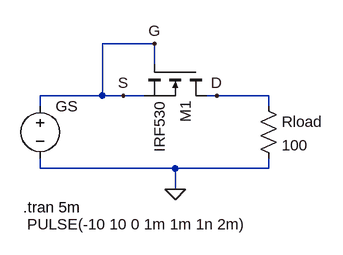
[diagram p0: schematic lab_02_Diode_Loesung.asc]
lab_02_Diode_Loesung.asc, the LTspice schematic file:
Version 4
SHEET 1 880 680
WIRE 160 80 80 80
WIRE 160 112 160 80
WIRE 80 160 80 80
WIRE 80 160 -16 160
WIRE 112 160 80 160
WIRE 144 160 112 160
WIRE 256 160 240 160
WIRE 336 160 256 160
WIRE -16 176 -16 160
WIRE 336 176 336 160
WIRE -16 272 -16 256
WIRE 192 272 -16 272
WIRE 336 272 336 256
WIRE 336 272 192 272
WIRE 192 304 192 272
FLAG 160 80 G
FLAG 256 160 D
FLAG 112 160 S
FLAG 192 304 0
SYMBOL nmos 240 112 R90
SYMATTR InstName M1
SYMATTR Value IRF530
SYMBOL voltage -16 160 R0
WINDOW 3 -20 198 Left 2
WINDOW 123 0 0 Left 0
WINDOW 39 0 0 Left 0
SYMATTR InstName GS
SYMATTR Value PULSE(-10 10 0 1m 1m 1n 2m)
SYMBOL res 320 160 R0
SYMATTR InstName Rload
SYMATTR Value 100
TEXT -42 332 Left 2 !.tran 5m

The netlist it stands for:
* lab_02_Diode_Loesung.asc
M1 D S S S IRF530
V§GS S 0 PULSE(-10 10 0 1m 1m 1n 2m)
Rload D 0 100
.model NMOS NMOS
.model PMOS PMOS
.lib standard.mos
.tran 5m
.backanno
.end